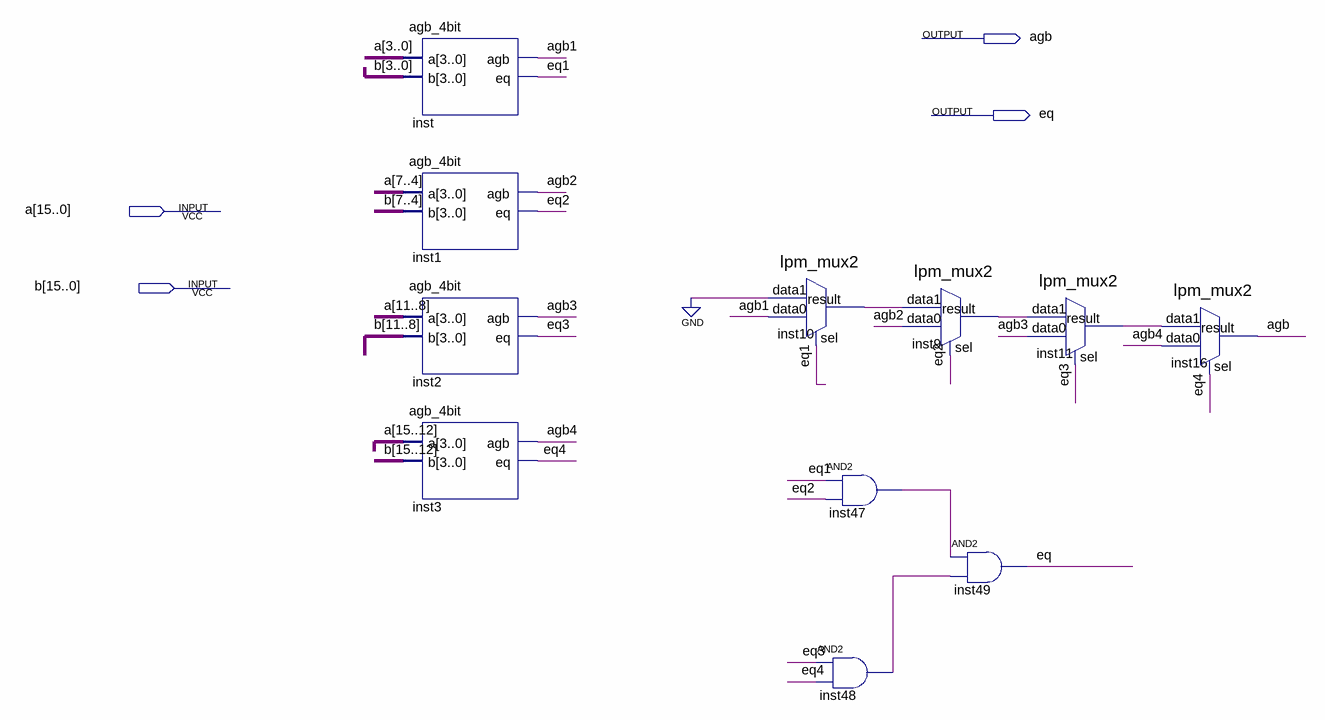
[diagram p0: schematic sheet]
// Quartus schematic agb_16bit.bdf as structural Verilog: 11 symbols, 4 pins
module agb_16bit (
  input  [15:0] a,
  input  [15:0] b,
  output agb,
  output eq
);

  wire agb1, agb2, agb3, agb4, eq1, eq2, eq3, eq4, inst9_result, inst10_result, inst11_result, inst47_out,
       inst48_out;

  agb_4bit inst (.a(a[3:0]), .b(b[3:0]), .agb(agb1), .eq(eq1));
  agb_4bit inst1 (.a(a[7:4]), .b(b[7:4]), .agb(agb2), .eq(eq2));
  agb_4bit inst2 (.a(a[11:8]), .b(b[11:8]), .agb(agb3), .eq(eq3));
  agb_4bit inst3 (.a(a[15:12]), .b(b[15:12]), .agb(agb4), .eq(eq4));
  lpm_mux2 inst10 (.data1(1'b0), .data0(agb1), .sel(eq1), .result(inst10_result));
  and inst47 (inst47_out, eq1, eq2);
  and inst48 (inst48_out, eq3, eq4);
  lpm_mux2 inst9 (.data1(inst10_result), .data0(agb2), .sel(eq2), .result(inst9_result));
  and inst49 (eq, inst47_out, inst48_out);
  lpm_mux2 inst11 (.data1(inst9_result), .data0(agb3), .sel(eq3), .result(inst11_result));
  lpm_mux2 inst16 (.data1(inst11_result), .data0(agb4), .sel(eq4), .result(agb));
endmodule
